# Altium schematic sheet MCU_32_1.SchDoc
size A4
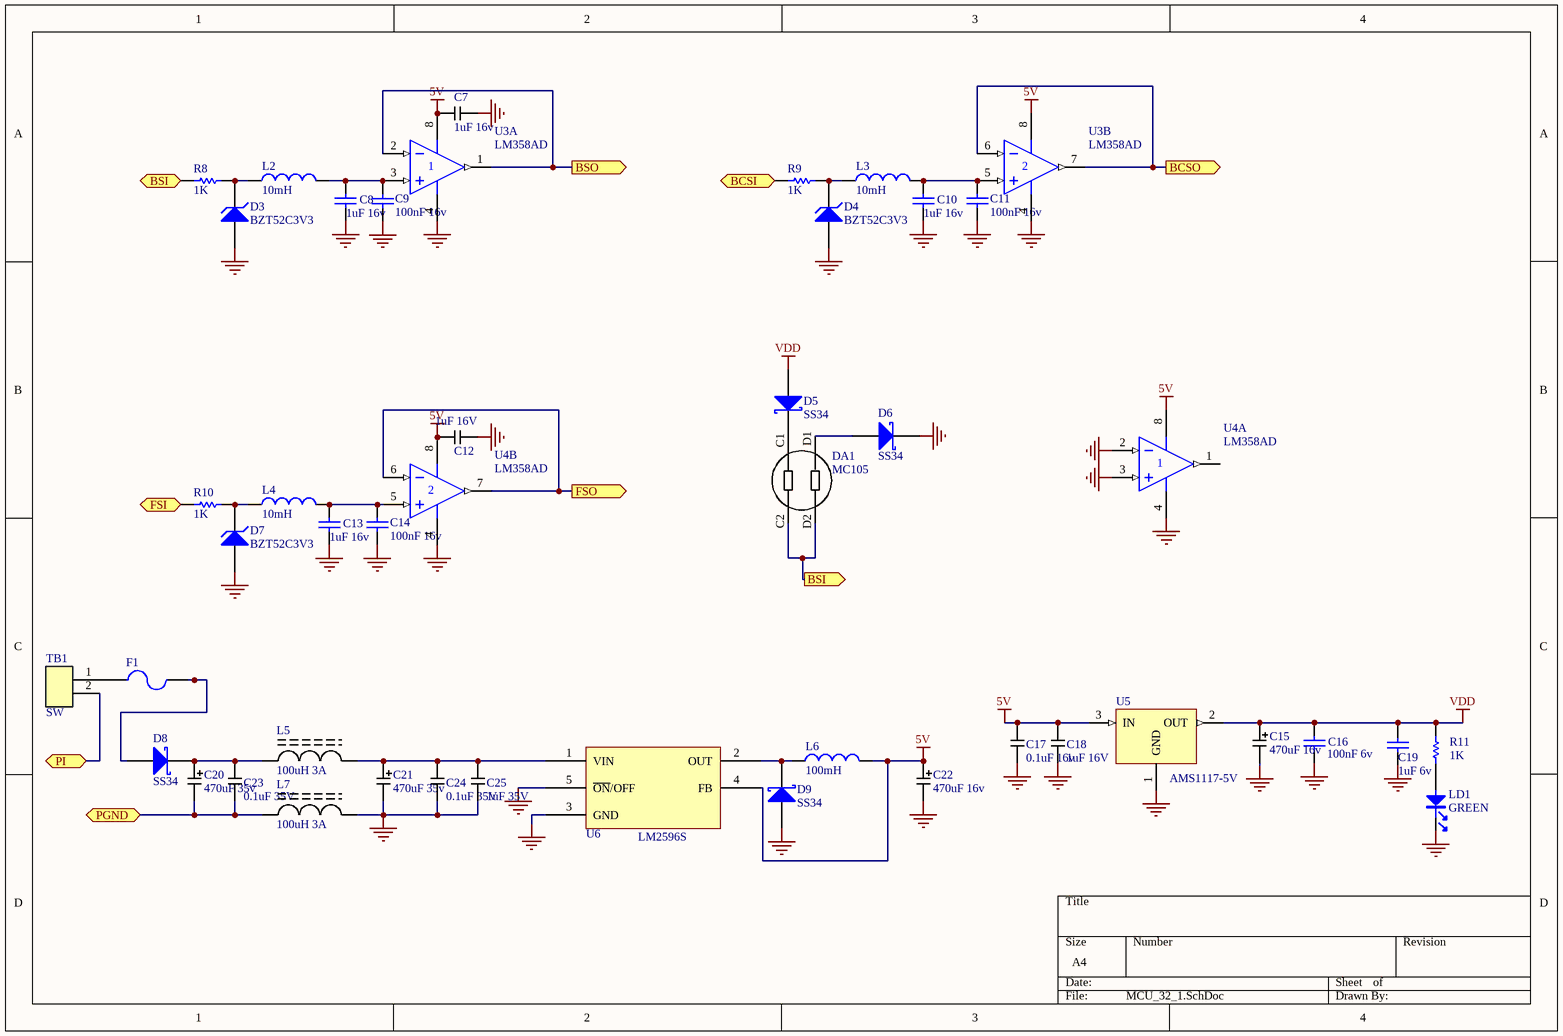
[diagram p0: MCU_32_1.SchDoc]

## Parts
C7  1uF 16v  [C1206]
C8  1uF 16v  [0603C]
C9  100nF 16v  [0603C]
C10  1uF 16v  [0603C]
C11  100nF 16v  [0603C]
C12  1uF 16V  [C1206]
C13  1uF 16v  [0603C]
C14  100nF 16v  [0603C]
C15  470uF 16v  [C_EL_8]
C16  100nF 6v  [0603C]
C17  0.1uF 16v  [C1206]
C18  1uF 16V  [C1206]
C19  1uF 6v  [0603C]
C20  470uF 35v  [C_EL_10]
C21  470uF 35v  [C_EL_10]
C22  470uF 16v  [C_EL_8]
C23  0.1uF 35V  [C1206]
C24  0.1uF 35V  [C1206]
C25  1uF 35V  [C1206]
D3  BZT52C3V3  [SOD-123]
D4  BZT52C3V3  [SOD-123]
D5  SS34  [SMB]
D6  SS34  [SMB]
D7  BZT52C3V3  [SOD-123]
D8  SS34  [SMB]
D9  SS34  [SMB]
DA1  MC105  [MC105]
F1  Fuse 2  [1812]  (value not drawn)
L2  10mH  [6-0805_L]
L3  10mH  [6-0805_L]
L4  10mH  [6-0805_L]
L5  100uH 3A  [NR60]
L6  100mH  [IND12500]
L7  100uH 3A  [NR60]
LD1  GREEN  [0603D_R]
R8  1K  [0603R]
R9  1K  [0603R]
R10  1K  [0603R]
R11  1K  [0603R]
TB1  SW  [terminal block2p]
U3  LM358AD  [SO-8]  (parts A,B of 2)
U4  LM358AD  [SO-8]  (parts A,B of 2)
U5  AMS1117-5V  [AMS1117]
U6  LM2596S  [TO-263]

## Ports
BCSI (in), BCSO (out), BSI (in), BSI (out), BSO (out), FSI (in), FSO (out), PGND (bidir), PI (bidir)

## Nets
5V: C7.1 C12.1 C17.1 C18.1 C22.1 L6.2 U3.8(V+) U4.8(V+) U5.3(IN) U6.4(FB)
GND: C7.2 C8.2 C9.2 C10.2 C11.2 C12.2 C13.2 C14.2 C15.2 C16.1 C17.2 C18.2 C19.2 C21.2 C22.2 C24.2 C25.2 D3.1(A) D4.1(A) D6.2(K) D7.1(A) D9.1(A) L7.2 LD1.2 U3.4(V-) U4.2(IN-) U4.3(IN+) U4.4(V-) U5.1(GND) U6.3(GND) U6.5(~{ON}/OFF)
VDD: C15.1 C16.2 C19.1 D5.1(A) R11.2 U5.2(OUT)
BCSI: R9.2 ; port BCSI
BCSO: U3.6(IN-) U3.7(OUT) ; port BCSO
BSI: DA1.C2 DA1.D2 R8.2 ; port BSI
BSO: U3.1(OUT) U3.2(IN-) ; port BSO
FSI: R10.2 ; port FSI
FSO: U4.6(IN-) U4.7(OUT) ; port FSO
PGND: C20.2 C23.2 L7.1 ; port PGND
PI: TB1.2 ; port PI
NetC8_1: C8.1 C9.1 L2.2 U3.3(IN+)
NetC10_1: C10.1 C11.1 L3.2 U3.5(IN+)
NetC13_1: C13.1 C14.1 L4.2 U4.5(IN+)
NetC20_1: C20.1 C23.1 D8.2(K) L5.1
NetC21_1: C21.1 C24.1 C25.1 L5.2 U6.1(VIN)
NetD3_2: D3.2(K) L2.1 R8.1
NetD4_2: D4.2(K) L3.1 R9.1
NetD5_2: D5.2(K) DA1.C1
NetD6_1: D6.1(A) DA1.D1
NetD7_2: D7.2(K) L4.1 R10.1
NetD8_1: D8.1(A) F1.2
NetD9_2: D9.2(K) L6.1 U6.2(OUT)
NetF1_1: F1.1 TB1.1
NetLD1_1: LD1.1 R11.1

Not connected (* = marked no-connect by the designer): U4 1(OUT)

## Library data of the parts
C7 = C: Capacitor 1uF 16v
C8 C10 C13 C19 = CAP SMD 0603  X5R 1µF 25V 10%: 0603  X5R 1µF; Rated voltage: 25V; Tolerance: 10%; Manufacturer: *; Manufacturer P/N: *; Order code Farnell: 1288202RL; Value: 1µF; Power: *; Technology: X5R; Temperature  Factor: *; Temperature Max: +125°C; Temperature Min: -55°C; STS Code: *
C9 C11 C14 = CAP: Capacitor; Value: 100pF; Published: 8-Jun-2000; Revision: July-2002: Re-released for DXP Platform.; Publisher: Altium Limited
C12 C18 = C: Capacitor 1uF 16V
C15 C20-C22 = CP: Capacitor polarized
C16 = Capacitor_ST: Capacitor 0402 / 0603 / 0805; Revision: July-2002: Re-released for DXP Platform.; Value: 100nF
C17 = C: Capacitor 0.1uF 12V
C23 = C: Capacitor 0.1uF 35V
C24 = C: Capacitor 0.1uF 25V
C25 = C: Capacitor 1uF 25V
D3 D4 D7 = BZT52C3V6: Surface Mount Zener Diode; Published: 8-Jun-2000; LatestRevisionDate: 17-Jul-2002; LatestRevisionNote: Re-released for DXP Platform.; DatasheetDocument: REV. L-2; PackageReference: SOD-123; Publisher: Altium Limited; ComponentLink1Description: Manufacturer Link; ComponentLink1URL: http://www.vishay.com/
D5 D6 D8 D9 = D Schottky: Schottky Diode 40V 3A; Published: 8-Jun-2000; LatestRevisionDate: 17-Jul-2002; LatestRevisionNote: Re-released for DXP Platform.; PackageReference: SMB; Publisher: Altium Limited; PackageDescription: DO-214-AA/SMB; 2 C-Bend Leads; Body 5.3 x 3.6 mm, inc. leads (LxW); Code_JEDEC: DO-214-AA
F1 = Fuse 2: Fuse; Published: 8-Jun-2000; LatestRevisionDate: 17-Jul-2002; LatestRevisionNote: Re-released for DXP Platform.; PackageReference: PIN-W2/E2.8; Publisher: Altium Limited; PackageDescription: Thru-Hole; 2 Leads
L2-L4 L6 = Inductor: Code_IEC: 1005; Published: 8-Jun-2000; LatestRevisionDate: 29-May-2009; LatestRevisionNote: IPC-7351 Footprint Added.; PackageReference: 0402-A; Publisher: Altium Limited; PackageDescription: Chip Inductor; Code_JEITA: 0402
  L2-L4: Value: 10mH
  L6: Value: 100mH
L5 = L: Inductor 100uH 3A
L7 = L: Inductor 100uH 23
LD1 = PHOTO
R8-R10 = Res1: Resistor; Published: 8-Jun-2000; Revision: July-2002: Re-released for DXP Platform.; Publisher: Altium Limited; Value: 1K
R11 = Resistor_ST: Resistor 0402 / 0603 / 0805; Value: 10K
TB1 = Terminal block 2p: Terminal block 2p 2.54mm; Value: =Value
U3 U4 = LM358AD: Dual Operational Amplifier; Published: 15-Apr-2002; LatestRevisionDate: 13-Apr-2006; LatestRevisionNote: IPC-7351 Footprint Added.; DatasheetVersion: Aug-1988; PackageVersion: Jan-1998; PackageReference: D008; Publisher: Altium Limited; PackageDescription: 8-Pin Small Outline Integrated Circuit 1.27 mm Pitch; Code_IPC: SOIC127P600-8; ComponentLink1Description: Manufacturer Link; ComponentLink1URL: http://www.ti.com/; ComponentLink2Description: Datasheet; ComponentLink2URL: http://www-s.ti.com/sc/ds/lm358.pdf
U5 = AMS1117
U6 = TI LM2596